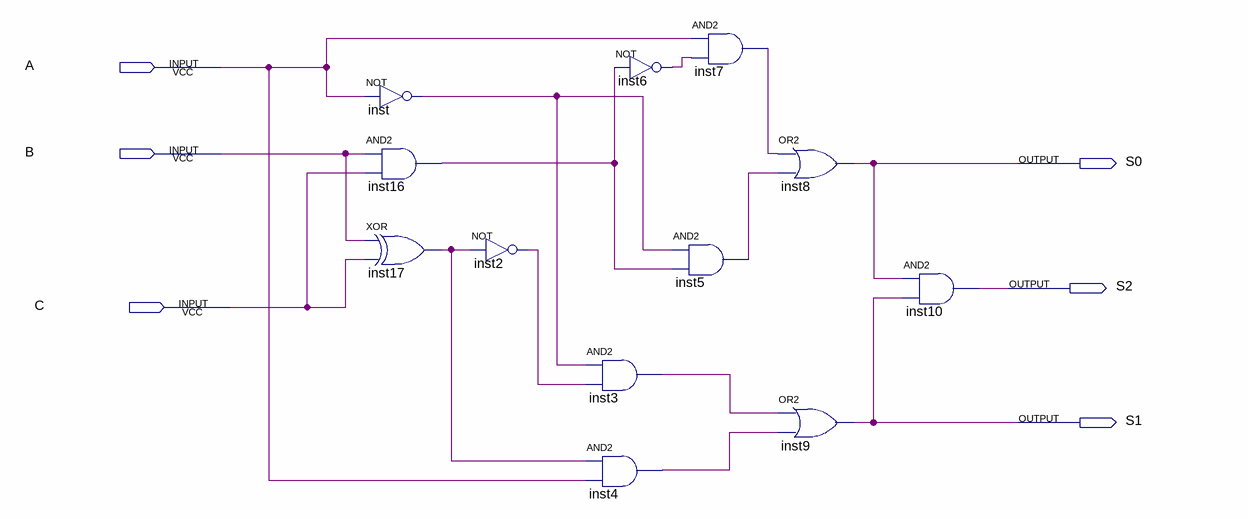
[diagram p0: schematic sheet]
// Quartus schematic quartus.bdf as structural Verilog: 12 symbols, 6 pins
module quartus (
  input  A,
  input  B,
  input  C,
  output S0,
  output S2,
  output S1
);

  wire inst2_out, inst3_out, inst4_out, inst5_out, inst6_out, inst7_out, inst16_out, inst17_out, inst_out;

  not inst (inst_out, A);
  and inst16 (inst16_out, B, C);
  xor inst17 (inst17_out, B, C);
  not inst2 (inst2_out, inst17_out);
  and inst3 (inst3_out, inst_out, inst2_out);
  and inst4 (inst4_out, inst17_out, A);
  not inst6 (inst6_out, inst16_out);
  and inst5 (inst5_out, inst_out, inst16_out);
  and inst7 (inst7_out, A, inst6_out);
  or inst8 (S0, inst7_out, inst5_out);
  or inst9 (S1, inst3_out, inst4_out);
  and inst10 (S2, S0, S1);
endmodule
